# EAGLE design blinkmusb_b1_pcbjack (EAGLE 5.11)
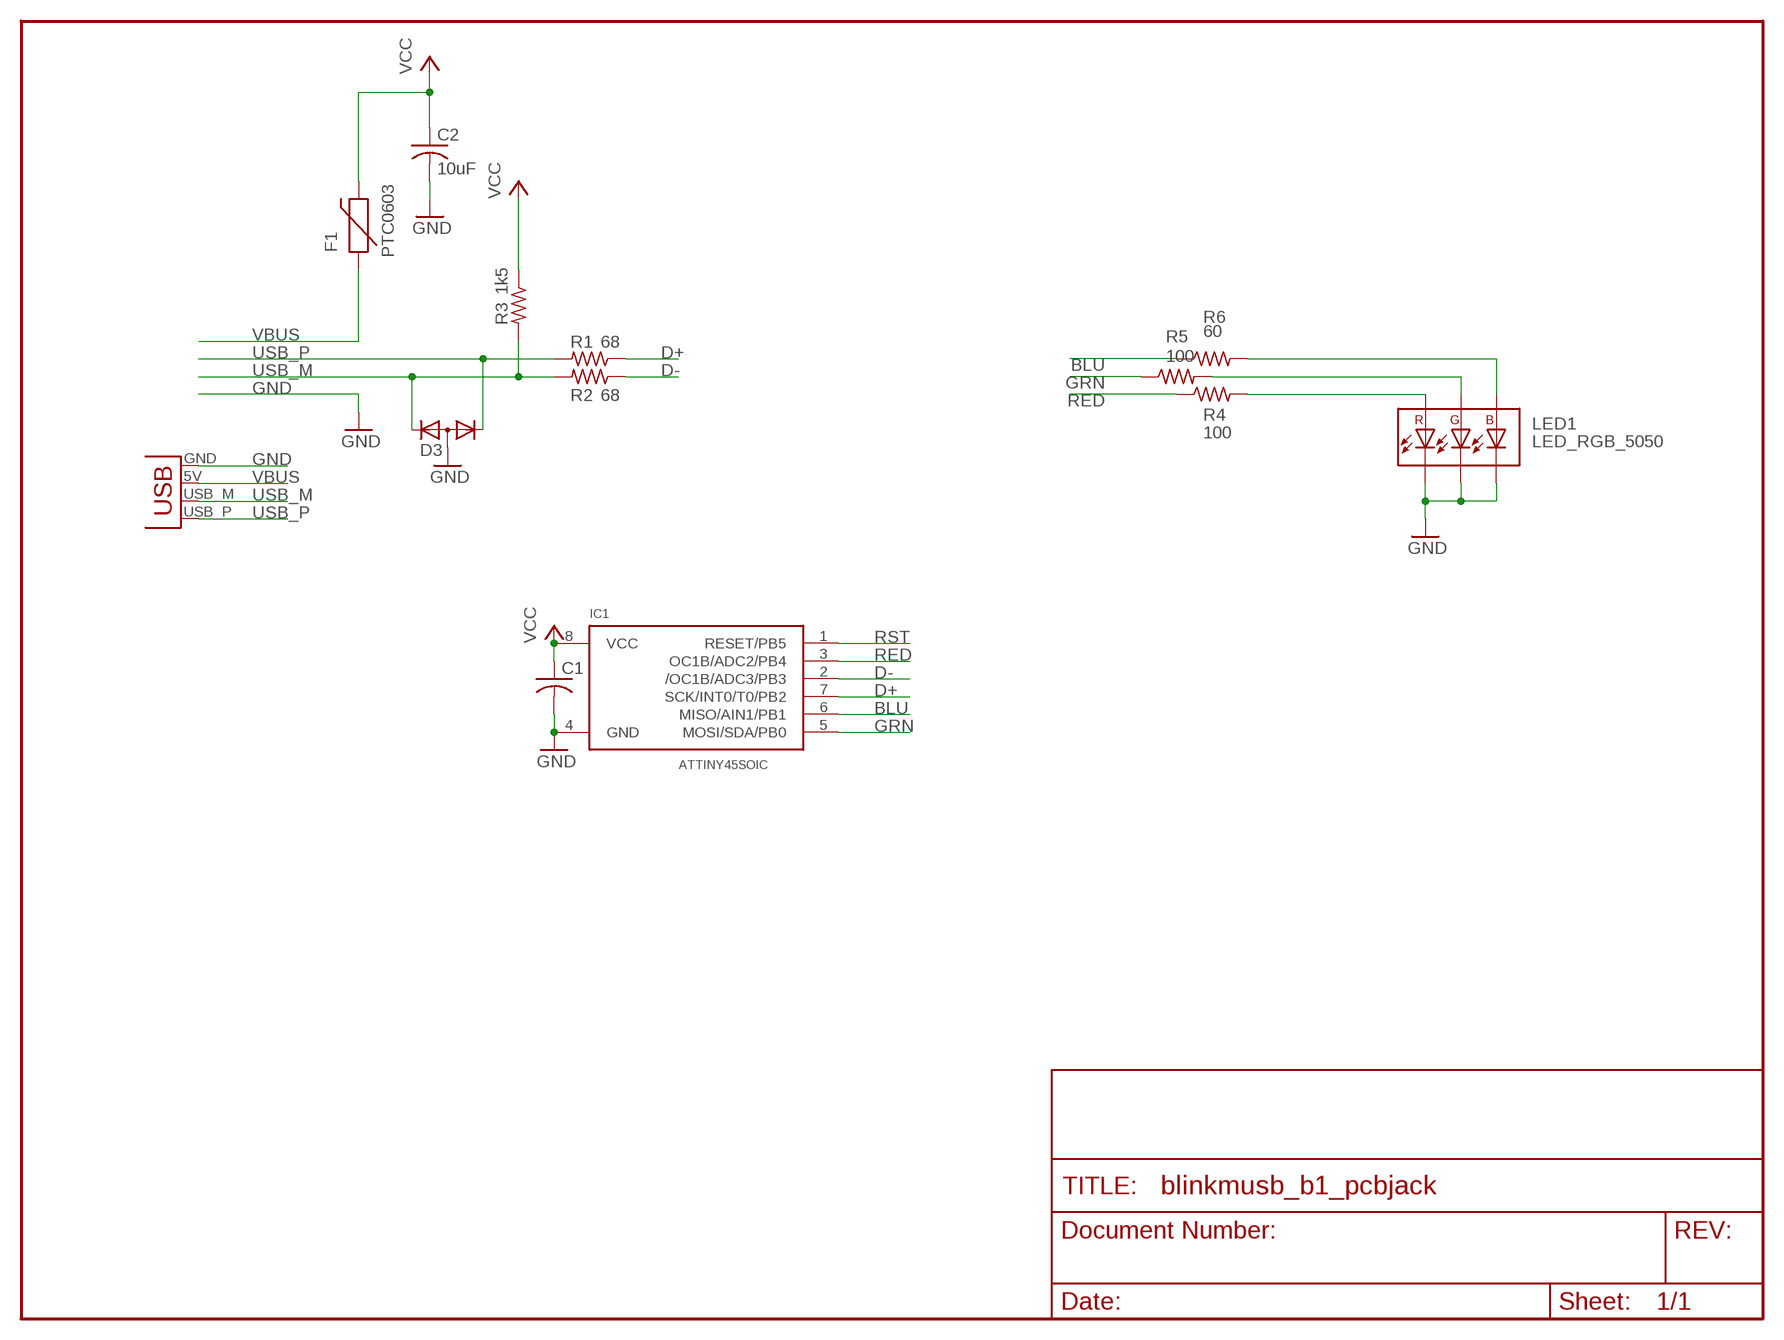
[diagram p0: schematic, sheet 1]

## Parts
C1  C-USC0603  [C0603]
C2  10uF  C-USC0805  [C0805]
D3  DIODE-2CA|ACSOT23  [SOT23]
F1  PTC0603  [0603]
IC1  ATTINY45SOIC  [SO08-EIAJ]
LED1  LED_RGB_5050  [LED_5050]
R1  68  R-US_R0603  [R0603]
R2  68  R-US_R0603  [R0603]
R3  1k5  R-US_R0603  [R0603]
R4  100  R-US_R0603  [R0603]
R5  100  R-US_R0603  [R0603]
R6  60  R-US_R0603  [R0603]
X2  USBPCB  [USB-A-PCB]

## Nets
BLU: IC1.6(MISO/AIN1/PB1) R6.1
D+: IC1.7(SCK/INT0/T0/PB2) R1.1
D-: IC1.2(/OC1B/ADC3/PB3) R2.1
GND: C1.2 C2.2 D3.3(A) IC1.4(GND) LED1.P$4(C2) LED1.P$5(C1) LED1.P$6(C0) X2.GND
GRN: IC1.5(MOSI/SDA/PB0) R5.1
RBLU: LED1.P$3(A2) R6.2
RED: IC1.3(OC1B/ADC2/PB4) R4.1
RGRN: LED1.P$2(A1) R5.2
RRED: LED1.P$1(A0) R4.2
RST: IC1.1(RESET/PB5)
USB_M: D3.2(K2) R2.2 R3.2 X2.USB_M(D-)
USB_P: D3.1(K1) R1.2 X2.USB_P(D+)
VBUS: F1.1 X2.5V(VBUS)
VCC: C1.1 C2.1 F1.2 IC1.8(VCC) R3.1

## Library data of the parts
C1 C2 = rcl:C-US: CAPACITOR, American symbol
D3 = diode:DIODE-2CA|AC: Dual DIODE Cathode-Anode|Anode-Cathode
F1 = SparkFun-20110517:PTC: Resettable Fuse PTC Resettable Fuse. Spark Fun Electronics SKU : COM-08357
IC1 = todstuff:ATTINY45
LED1 = todstuff:LED_RGB_5050
R1-R6 = rcl:R-US_: RESISTOR, American symbol
X2 = SparkFun-20110517:USB: USB Connectors USB-B-PTH is fully proven SKU : PRT-00139 USB-miniB is fully proven SKU : PRT-00587 USB-A-PCB is untested. USB-A-H is throughly reviewed, but untested. Spark Fun Electronics SKU : PRT-00437 USB-B-SMT is throughly reviewed, but untested. Needs silkscreen touching up. USB-A-S has not been used/tested USB-MB-H has not been used/tested

## Board
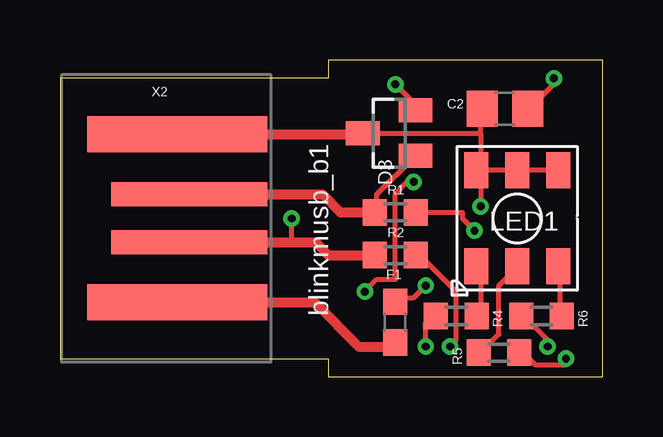
[diagram p1: board, top side]
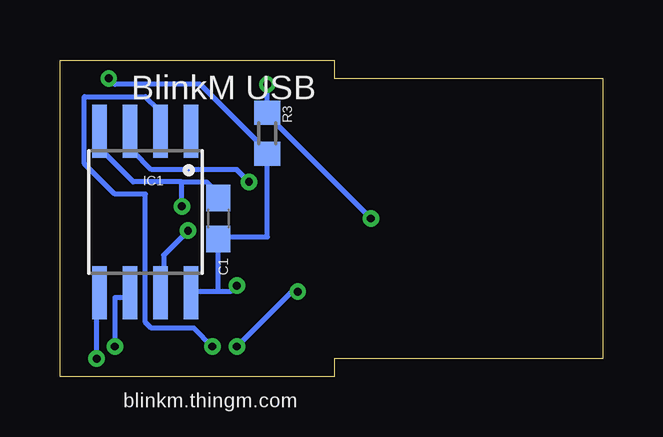
[diagram p2: board, bottom side, seen from below]

Size 22.61 x 13.21 mm. Coordinates in mm from the lower left corner, seen from the top.
Outline: 0,0.76 11.18,0.76 11.18,0 22.61,0 22.61,0.76 22.61,12.45 22.61,13.21 20.32,13.21 11.18,13.21 11.18,12.45 0,12.45 0,0.76
Copper layers (1*16): Top 0.0356mm / dielectric 1.5011mm / Bottom 0.0356mm
Design rules "LaenPCBOrder *": minimum track width 8mil, minimum drill 13mil, track to track 6mil, track to pad 8mil, pad to pad 8mil, via to via 8mil, smd to smd 6mil, copper to edge 15mil, drill to drill 8mil, minimum pad ring 7mil, minimum via ring 7mil, stop-mask expansion 4mil, vias tented up to drill 25mil, thermal gap 10mil
tRestrict: area 0,0.8 to 8.9,12.7

### Footprints (pad centres in the part's own frame; a part is rotated, then mirrored left to right if it is on the bottom)
C0603 = smd 1.1 x 1: 1 -0.85,0; 2 0.85,0
C0805 = smd 1.3 x 1.5: 1 -0.95,0; 2 0.95,0
SOT23 = smd 1 x 1.4: 1 -0.95,-1.1; 2 0.95,-1.1; 3 0,1.1
0603 = smd 1.1 x 1: 1 -0.85,0; 2 0.85,0
SO08-EIAJ = smd 0.61 x 2.21: 1 -1.905,-3.378; 2 -0.635,-3.378; 3 0.635,-3.378; 4 1.905,-3.378; 5 1.905,3.353; 6 0.635,3.353; 7 -0.635,3.353; 8 -1.905,3.353
LED_5050 = smd 1 x 1.5: P$1 1.7,2; P$2 0,2; P$3 -1.7,2; P$4 -1.7,-2; P$5 0,-2; P$6 1.7,-2
R0603 = smd 1 x 1.1: 1 -0.85,0; 2 0.85,0
USB-A-PCB = smd 7.5 x 1.5: 5V -0.2,-3.5; GND -0.2,3.5 | smd 6.5 x 1: USB_M 0.3,-1; USB_P 0.3,1

### Placement (x,y rotation side)
C1  16,6.6 90 bottom
C2  18.54,11.18 180 top
D3  13.72,10.16 90 top
F1  13.97,2.29 90 top
IC1  19.05,6.86 180 bottom
LED1  19.05,6.6 180 top
R1  13.97,6.86 180 top
R2  13.97,5.08 180 top
R3  13.97,10.16 90 bottom
R4  16.51,2.54 0 top
R5  18.29,1.02 180 top
R6  20.07,2.54 0 top
X2  5.08,6.6 0 top

### Tracks (layer width: path | path; a pad name or v marks a point on that pad's centre or on a via)
BLU  (via drill 0.33)
  Top 0.203: v20.32,1.27 20.32,1.52 19.3,2.54 R6.1
  Bottom 0.203: v20.32,1.27 20.32,3.3 19.81,3.3 IC1.6
D+  (via drill 0.33)
  Top 0.203: v17.27,6.1 16.76,6.6 16.76,6.86 14.99,6.86 R1.1
  Bottom 0.203: v17.27,6.1 18.29,5.08 18.29,3.56 IC1.7
D-  (via drill 0.33)
  Top 0.203: v16.26,1.27 16.51,1.52 16.51,3.56 14.99,5.08 R2.1
  Bottom 0.203: v16.26,1.27 17.02,2.03 18.8,2.03 19.05,2.29 19.05,7.62 20.32,7.62 21.59,8.89 21.59,11.68 19.05,11.68 18.54,11.18 18.54,10.41 IC1.2
GND  (via drill 0.33)
  Top 0.203: 17.53,8.64 19.05,8.64 | 17.53,8.64 LED1.P$6 | 19.05,8.64 LED1.P$5 19.05,8.64 | 19.05,8.64 20.57,8.64 LED1.P$4 | 17.53,10.16 17.53,8.64 | 17.53,10.16 17.53,11.18 C2.2 | 17.53,8.64 LED1.P$6 | 17.53,10.16 12.7,10.16 D3.3 | v17.53,7.11 17.53,8.38 LED1.P$6
  Top 0.406: X2.GND 12.56,10.1 D3.3
  Bottom 0.203: 17.53,8.13 19.56,8.13 20.83,9.4 20.83,10.16 IC1.4 | 17.53,8.13 16.51,8.13 16,7.62 C1.2 | v17.53,7.11 17.53,8.13
GRN  (via drill 0.33)
  Top 0.203: v21.08,0.76 21.08,0.51 19.81,0.51 19.3,1.02 R5.1
  Bottom 0.203: v21.08,0.76 21.08,3.3 IC1.5
RBLU
  Top 0.203: R6.2 20.83,2.54 20.83,4.57 LED1.P$3
RED  (via drill 0.33)
  Top 0.203: v15.24,1.27 15.24,2.29 15.49,2.54 R4.1 | v12.7,3.56 13.21,4.06 13.97,4.06 13.97,7.62 14.48,8.13 v14.73,8.13
  Bottom 0.203: v15.24,1.27 12.95,3.56 v12.7,3.56 | v14.73,8.13 15.24,8.64 18.8,8.64 19.56,9.4 19.56,10.16 IC1.3
RGRN
  Top 0.203: R5.2 17.53,1.02 18.29,1.78 18.29,3.81 19.05,4.57 LED1.P$2
RRED
  Top 0.203: R4.2 17.53,2.54 17.53,4.57 LED1.P$1
USB_M  (via drill 0.33)
  Top 0.203: v13.97,12.19 14.73,11.43 14.73,11.18 D3.2 | 9.65,5.6 9.65,5.59 9.65,5.6 | 9.65,5.6 v9.65,6.6
  Top 0.406: X2.USB_M 9.65,5.6 10.65,5.6 11.18,5.08 R2.2
  Bottom 0.203: v13.97,12.19 13.97,11.18 R3.2 13.97,10.92 v9.65,6.6
USB_P
  Top 0.203: D3.1 14.73,9.14 13.21,7.62 13.21,6.86 R1.2
  Top 0.406: X2.USB_P 10.94,7.6 11.68,6.86 R1.2
VBUS
  Top 0.406: X2.5V 10.61,3.1 12.45,1.27 13.8,1.27 F1.1
VCC  (via drill 0.33)
  Top 0.203: v15.24,3.81 14.73,3.3 13.97,3.3 F1.2 | v20.57,12.45 20.57,12.19 19.56,11.18 C2.1
  Bottom 0.203: v15.24,3.81 15.49,3.56 16,3.56 | 16,3.56 17.02,3.56 IC1.8 | 16,3.56 16,5.59 C1.1 16,5.84 13.97,5.84 13.97,9.14 R3.1 13.97,9.4 16.76,12.19 20.32,12.19 v20.57,12.45

### Text on the board
tPlace: blinkmusb_b1
bPlace: BlinkM USB | blinkm.thingm.com